# Altium schematic sheet StepDown_LM2596.SchDoc: =DocumentName
size A4; CompanyName: "AS Manufacturing" LLC; Organization: "AS Manufacturing" LLC; Address1: 5 Sklyarenka St.; Address2: Kyiv 04073; Address3: Ukraine; Address4: https://ajax.systems/en/; DocumentNumber: 7; SheetNumber: 7; SheetTotal: 7; Template_version: 1.0.1
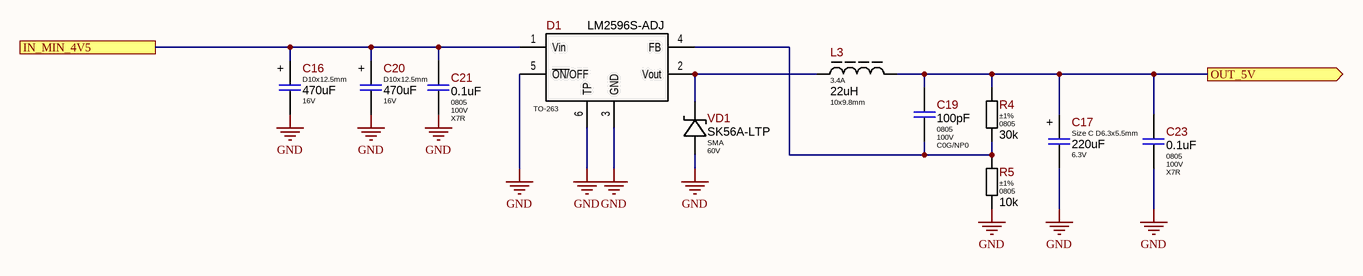
[diagram p0: StepDown_LM2596.SchDoc]

## Parts
C16  value 470uF  Package: D10x12.5mm  Voltage: 16V  [CAP-AE-PTH-100D10x125H15]  (hidden comment: 470uFx16V)
C17  value 220uF  Package: Size C D6.3x5.5mm  Voltage: 6.3V  [CAP-AE-660x550H20_MED]  (hidden comment: 220uFx6.3V)
C19  Package: 0805  Voltage: 100V  Dielectric Type: C0G/NP0  [CAP-0805(2012)X60T10]  (hidden comment: 100pF)
C20  value 470uF  Package: D10x12.5mm  Voltage: 16V  [CAP-AE-PTH-100D10x125H15]  (hidden comment: 470uFx16V)
C21  Package: 0805  Voltage: 100V  Dielectric Type: X7R  [C_CERAMIC_0805_MED]  (hidden comment: 0.1uF)
C23  Package: 0805  Voltage: 100V  Dielectric Type: X7R  [C_CERAMIC_0805_MED]  (hidden comment: 0.1uF)
D1  Package: TO-263  [TO-263-5-1]  (hidden comment: LM2596S-ADJ)
L3  Current: 3.4A  Package: 10x9.8mm  [SRN1060-Series]  (hidden comment: 22uH)
R4  Tolerance: ±1%  Package: 0805  [R_ANY_CHIP_0805_MED]  (hidden comment: 30k)
R5  Tolerance: ±1%  Package: 0805  [R_ANY_CHIP_0805_MED]  (hidden comment: 10k)
VD1  Package: SMA  Voltage: 60V  [SMA_MED]  (hidden comment: SK56A-LTP)

## Ports
IN_MIN_4V5, OUT_5V (out)

## Nets
GND: C16.2 C17.2 C20.2 C21.2 C23.2 D1.3(GND) D1.5(~{ON/}OFF) D1.6(TP) R5.2 VD1.AN
IN_MIN_4V5: C16.1 C20.1 C21.1 D1.1(Vin) ; port IN_MIN_4V5
OUT_5V: C17.1 C19.2 C23.1 L3.2 R4.1 ; port OUT_5V
NetC19_1: C19.1 D1.4(FB) R4.2 R5.1
NetD1_2: D1.2(Vout) L3.1 VD1.CA

## Notes on the sheet
- Title
- Product:
- Project:
- Size:
- Date:
- Variant:
- A4
- Authors:
- Time:
- Sheet
- of
- Revision:
- @Vitech_ua
- Commit:
- (in symbol ELV221M0JRC) +
- (in symbol EXR471M16B) +

## Library data of the parts
C16 C20 = EXR471M16B: 470uF 16V D10x12.5mm Electrolytic Low Impedance; Manufacturer: Hitano; Ajax_1C_ID: 15747; Ajax_1C_PN: 470uF 16V 10x12.5mm EXR EXR471M16B-Hitano pcs; Ajax_1С_Status: Mass Production; Standard Lead Time: NONE; Component Status: Released; Tolerance: ±20%; GUID_1C: 3364ee07-6280-11e9-ab4f-0050569f2651; Part Number: EXR471M16B; Part Type: Aluminum; Component Type: PTH; Temperature Range: -40°C ~ 105°C; Dielectric Type: NONE; ComponentLink1URL: https://www.hitano.com.tw/wp-content/uploads/doc/EXR_20200408.pdf; Replacement: NONE; Price: 0,045; ComponentLink1Description: Datasheet
C17 = ELV221M0JRC: 220uF 6.3V ±20% Size C D6.3x5.5mm SMD Electrolytic Capacitor; Manufacturer: Hitano; Ajax_1C_ID: 8271; Ajax_1C_PN: 220uF 6,3V ELV SMD sizeC 6.3x5.5 (ELV221M0JRC); Ajax_1С_Status: RND Only; Standard Lead Time: NONE; Component Status: Released; GUID_1C: 5aa8f084-0ddb-11e6-818c-d8cb8a9acc66; Part Number: ELV221M0JRC; Part Type: Aluminum; Component Type: SMD; Temperature Range: -40°C ~ 85°C; Tolerance: ±20%; Dielectric Type: NONE; ComponentLink1URL: https://www.hitano.com.tw/wp-content/uploads/doc/ELV_20200810.pdf; Replacement: NONE; Price: 0,07793566; ComponentLink1Description: Datasheet
C19 = CC0805JRNPO0BN101: 100pF 100V C0G, NP0 ±5% 0805 Ceramic Capacitor RoHS; Manufacturer: Yageo; Ajax_1C_PN: NONE; Ajax_1С_Status: RND Only; Standard Lead Time: 14 Weeks; Component Status: Released; Value: 100pF; Part Number: CC0805JRNPO0BN101; Part Type: Ceramic / C0G(NP0) / 0805; Component Type: SMD; Temperature Range: -55°C ~ 125°C; Tolerance: ±5%; ComponentLink1URL: https://eu.mouser.com/datasheet/2/447/UPY_NP0X7R_MV_100_to_630V_24-2604388.pdf; Supplier 1: Mouser; Supplier Part Number 1: 603-CC805JRNPO0BN101; Replacement: NONE; Price: NONE; ComponentLink1Description: Datasheet
C21 C23 = CL21B104KCFSFNE: 100nF 100V X7R ±10% 0805 Ceramic Capacitor RoHS; Manufacturer: Samsung Electro-Mechanics; Ajax_1C_ID: 12279; Ajax_1C_PN: 100nF 100V X7R 10% 0805 CL21B104KCFSFNE Ceramic Capacitor SMD RoHS; Ajax_1С_Status: Mass Production; Standard Lead Time: 22 Weeks; Component Status: Released; Replacement: NONE; GUID_1C: e54cb00c-325f-11e8-822c-14dda9d2d04d; Value: 0.1uF; Part Number: CL21B104KCFSFNE; Part Type: Ceramic / X7R / 0805; Component Type: SMD; Temperature Range: -55°C ~ 125°C; Tolerance: ±10%; ComponentLink1URL: https://media.digikey.com/pdf/Data%20Sheets/Samsung%20PDFs/CL_Series_MLCC_ds.pdf; Supplier 1: Digi-Key; Supplier Part Number 1: 1276-2923-2-ND; Price: 0,0054; ComponentLink1Description: Datasheet
D1 = LM2596S-ADJ: SIMPLE SWITCHER Power Converter 150-kHz 3-A Step-Down Voltage Regulator; Manufacturer: Texas Instruments; Ajax_1C_ID: 5535; Ajax_1C_PN: LM2596S-ADJ 150 kHz 3A Step-Down Voltage Regulator; Ajax_1С_Status: Mass Production; Standard Lead Time: 6 Weeks; Component Status: Released; Replacement: NONE; GUID_1C: db77318d-6bf0-11e4-9c1d-a45d36c4a9e5; Part Number: LM2596S-ADJ; Part Type: Power / DC-DC / Buck; Component Type: SMD; Temperature Range: -40°C ~ 125°C; ComponentLink1URL: http://www.ti.com/lit/ds/symlink/lm2596.pdf; Supplier 1: Mouser; Supplier Part Number 1: 926-LM2596S-ADJ/NOPB; Price: 0,44526902; ComponentLink1Description: Datasheet
L3 = SRN1060-220M: 22uH Semi-Shielded Wirewound Inductor 3.4A 53mOhm Max; Manufacturer: Bourns Inc; Ajax_1C_ID: 13643; Ajax_1C_PN: 22uH SRN1060-220M SMD inductor; Ajax_1С_Status: Mass Production; Tolerance: ±20%; Component Status: Released; Standard Lead Time: 20 Weeks; Replacement: NONE; GUID_1C: 57004023-b026-11e8-ab45-005056918265; Value: 22uH; Part Number: SRN1060-220M; Part Type: Power / Ferrite Core; Saturation Current: 3.4A; Component Type: SMD; Temperature Range: -40°C ~ 125°C; ComponentLink1URL: https://www.bourns.com/docs/Product-Datasheets/SRN1060.pdf; Supplier 1: Digi-Key; Supplier Part Number 1: SRN1060-220MTR-ND; Price: 0,2134301; ComponentLink1Description: Datasheet
R4 = RC0805FR-0730KL: 30 kOhms ±1%, 1/8W 0805 Thick Film Resistor; Manufacturer: Yageo; Ajax_1C_ID: 9642; Ajax_1C_PN: 30k 1% 0805 Resistors SMD RoHS; Ajax_1С_Status: Mass Production; Power Rating: 0.125W; Voltage: 150V; Component Status: Released; Temperature Stability: ±100ppm/°C; Replacement: NONE; GUID_1C: 71e2aa09-07e0-11e7-82d0-d8cb8a9acc66; Value: 30k; Part Number: RC0805FR-0730KL; Component Type: SMD; Part Type: Thick Film; Temperature Range: -55°C ~ 155°C; ComponentLink1URL: https://eu.mouser.com/datasheet/2/447/PYu_RC_Group_51_RoHS_L_10-1664068.pdf; Supplier 1: Digi-Key; Supplier Part Number 1: 311-30.0KCRTR-ND; Price: 0,001; ComponentLink1Description: Datasheet
R5 = RC0805FR-0710K2L: 10 kOhms ±1%, 1/8W 0805 Thick Film Resistor; Manufacturer: Yageo; Ajax_1C_ID: 13943; Ajax_1C_PN: 10.2k 1% 0805 Resistors SMD RoHS; Ajax_1С_Status: Mass Production; Power Rating: 0.125W; Voltage: 150V; Component Status: Released; Temperature Stability: ±100ppm/°C; Replacement: NONE; GUID_1C: 8bc9d0ce-c58a-11e8-ab47-0050569f2651; Value: 10k; Part Number: RC0805FR-0710K2L; Component Type: SMD; Part Type: Thick Film; Temperature Range: -55°C ~ 155°C; ComponentLink1URL: https://eu.mouser.com/datasheet/2/447/PYu_RC_Group_51_RoHS_L_10-1664068.pdf; Supplier 1: Digi-Key; Supplier Part Number 1: 311-10.2KCRTR-ND; Price: 0,0014; ComponentLink1Description: Datasheet
VD1 = SK56A-LTP: Diode Schottky 60V 5A, SMA; Manufacturer: Micro Commercial Components; Ajax_1C_ID: 12747; Ajax_1C_PN: SK56A-LTP диод; Ajax_1С_Status: Mass Production; Marking: SK56A; Component Status: Released; Standard Lead Time: 12 Weeks; Vf: 750mV @ 5A; Replacement: NONE; GUID_1C: b92aa543-5aa4-11e8-ab3c-0050569f2651; Part Number: SK56A-LTP; Part Type: Schottky; Component Type: SMD; Current: 5A; Temperature Range: -55°C ~ 150°C; ComponentLink1URL: https://www.mccsemi.com/pdf/Products/SK52A-L-SK510A-L(DO-214AC).pdf; Supplier 1: Digi-Key; Supplier Part Number 1: SK56A-LTPMSTR-ND; Price: 0,06; ComponentLink1Description: Datasheet